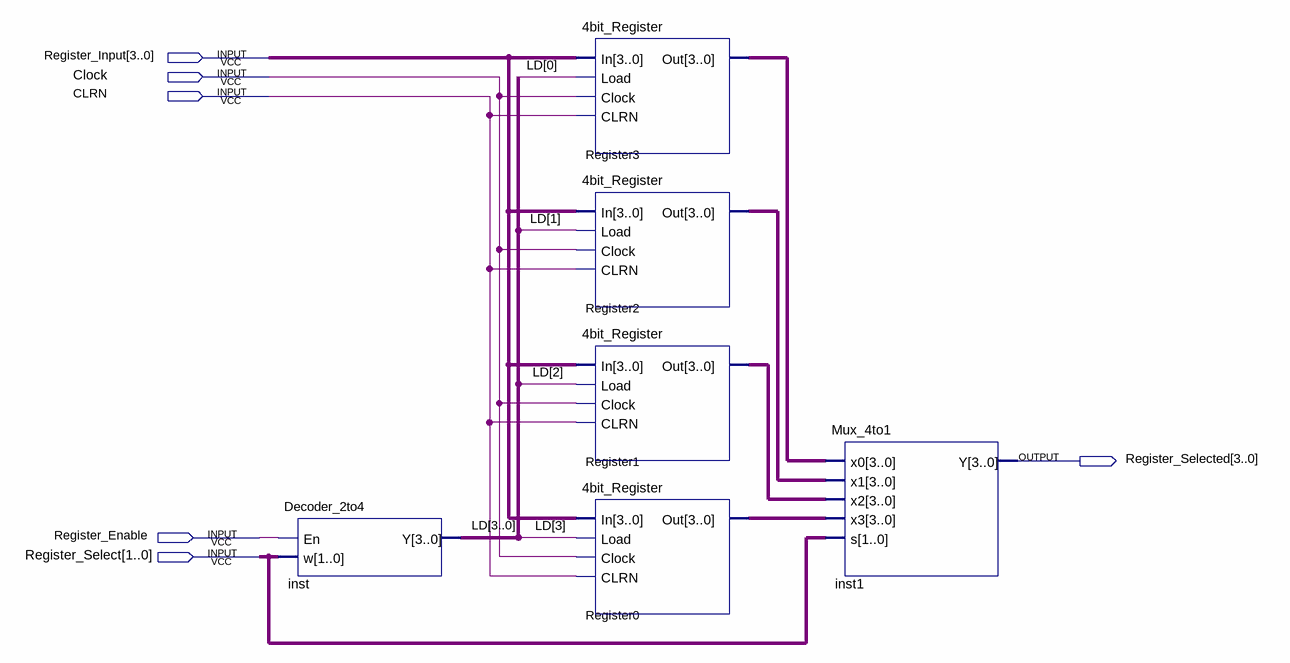
[diagram p0: schematic sheet]
// Quartus schematic 4_4bit_Register_File.bdf as structural Verilog: 6 symbols, 6 pins
module \4_4bit_Register_File  (
  input  [3:0] Register_Input,
  input  Clock,
  input  CLRN,
  input  Register_Enable,
  input  [1:0] Register_Select,
  output [3:0] Register_Selected
);

  wire [3:0] LD, Register0_out, Register1_out, Register2_out, Register3_out;

  Decoder_2to4 inst (.En(Register_Enable), .w(Register_Select), .Y(LD));
  \4bit_Register  Register3 (.In(Register_Input), .Load(LD[0]), .Clock(Clock), .CLRN(CLRN), .Out(Register3_out));
  \4bit_Register  Register2 (.In(Register_Input), .Load(LD[1]), .Clock(Clock), .CLRN(CLRN), .Out(Register2_out));
  \4bit_Register  Register1 (.In(Register_Input), .Load(LD[2]), .Clock(Clock), .CLRN(CLRN), .Out(Register1_out));
  \4bit_Register  Register0 (.In(Register_Input), .Load(LD[3]), .Clock(Clock), .CLRN(CLRN), .Out(Register0_out));
  Mux_4to1 inst1 (
    .x0(Register3_out), .x1(Register2_out), .x2(Register1_out), .x3(Register0_out), .s(Register_Select),
    .Y(Register_Selected));
endmodule
